# EAGLE schematic v7-flex2811_32x (EAGLE 7.3.0), part 1 of 2

## Sheet 1 of 32
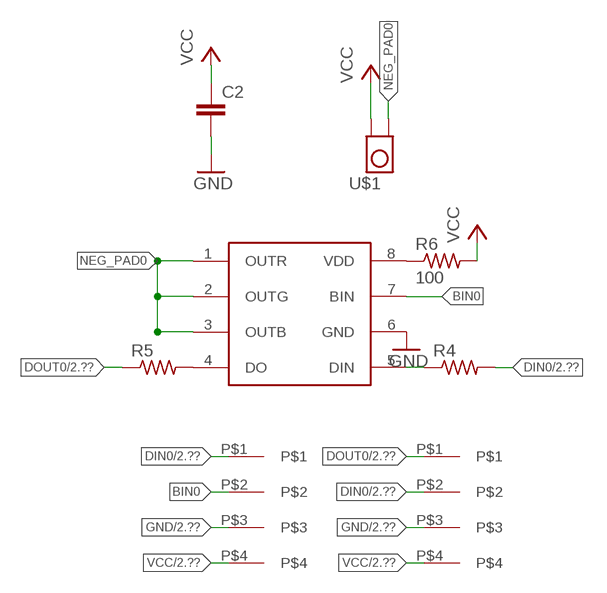
[diagram p0: schematic, sheet 1]

### Parts
C2  C-EUC0201  [C0201]
R4  R-US_R0201  [R0201]
R5  R-US_R0201  [R0201]
R6  100  R-US_R0201  [R0201]
U1  WS2818  [SO08]
U$1  TP_4MM_MED_PAD  [TP_4MM_MED_PAD]
U$3  4PAD  [4PAD]
U$4  4PAD  [4PAD]

### Nets
BIN0: U1.7(BIN) U$3.P$2
DIN0: R4.2 U$3.P$1 U$4.P$2 ; also sheet 2
DOUT0: R5.1 U$4.P$1 ; also sheet 2,3
GND: C2.2 U1.6(GND) U$3.P$3 U$4.P$3 ; also sheet 2,3,4,5,6,7,8,9,10,11,12,13,14,15,16,17,18,19,20,21,22,23,24,25,26,27,28,29,30,31,32
N$4: R4.1 U1.5(DIN)
N$5: R5.2 U1.4(DO)
N$6: R6.1 U1.8(VDD)
NEG_PAD0: U1.1(OUTR) U1.2(OUTG) U1.3(OUTB) U$1.P$1
VCC: C2.1 R6.2 U$1.P$2 U$3.P$4 U$4.P$4 ; also sheet 2,3,4,5,6,7,8,9,10,11,12,13,14,15,16,17,18,19,20,21,22,23,24,25,26,27,28,29,30,31,32

## Sheet 2 of 32
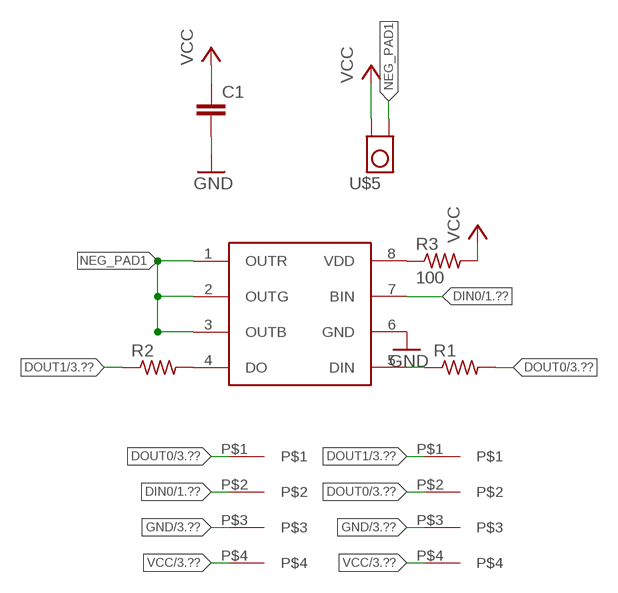
[diagram p1: schematic, sheet 2]

### Parts
C1  C-EUC0201  [C0201]
R1  R-US_R0201  [R0201]
R2  R-US_R0201  [R0201]
R3  100  R-US_R0201  [R0201]
U2  WS2818  [SO08]
U$5  TP_4MM_MED_PAD  [TP_4MM_MED_PAD]
U$7  4PAD  [4PAD]
U$8  4PAD  [4PAD]

### Nets
DIN0: U2.7(BIN) U$7.P$2 ; also sheet 1
DOUT0: R1.2 U$7.P$1 U$8.P$2 ; also sheet 1,3
DOUT1: R2.1 U$8.P$1 ; also sheet 3,4
GND: C1.2 U2.6(GND) U$7.P$3 U$8.P$3 ; also sheet 1,3,4,5,6,7,8,9,10,11,12,13,14,15,16,17,18,19,20,21,22,23,24,25,26,27,28,29,30,31,32
N$1: R1.1 U2.5(DIN)
N$2: R2.2 U2.4(DO)
N$3: R3.1 U2.8(VDD)
NEG_PAD1: U2.1(OUTR) U2.2(OUTG) U2.3(OUTB) U$5.P$1
VCC: C1.1 R3.2 U$5.P$2 U$7.P$4 U$8.P$4 ; also sheet 1,3,4,5,6,7,8,9,10,11,12,13,14,15,16,17,18,19,20,21,22,23,24,25,26,27,28,29,30,31,32

## Sheet 3 of 32
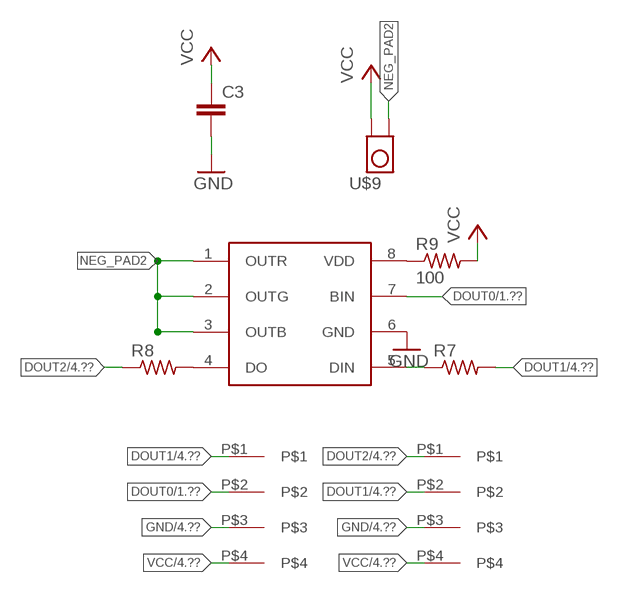
[diagram p2: schematic, sheet 3]

### Parts
C3  C-EUC0201  [C0201]
R7  R-US_R0201  [R0201]
R8  R-US_R0201  [R0201]
R9  100  R-US_R0201  [R0201]
U3  WS2818  [SO08]
U$9  TP_4MM_MED_PAD  [TP_4MM_MED_PAD]
U$11  4PAD  [4PAD]
U$12  4PAD  [4PAD]

### Nets
DOUT0: U3.7(BIN) U$11.P$2 ; also sheet 1,2
DOUT1: R7.2 U$11.P$1 U$12.P$2 ; also sheet 2,4
DOUT2: R8.1 U$12.P$1 ; also sheet 4,5
GND: C3.2 U3.6(GND) U$11.P$3 U$12.P$3 ; also sheet 1,2,4,5,6,7,8,9,10,11,12,13,14,15,16,17,18,19,20,21,22,23,24,25,26,27,28,29,30,31,32
N$7: R7.1 U3.5(DIN)
N$8: R8.2 U3.4(DO)
N$9: R9.1 U3.8(VDD)
NEG_PAD2: U3.1(OUTR) U3.2(OUTG) U3.3(OUTB) U$9.P$1
VCC: C3.1 R9.2 U$9.P$2 U$11.P$4 U$12.P$4 ; also sheet 1,2,4,5,6,7,8,9,10,11,12,13,14,15,16,17,18,19,20,21,22,23,24,25,26,27,28,29,30,31,32

## Sheet 4 of 32
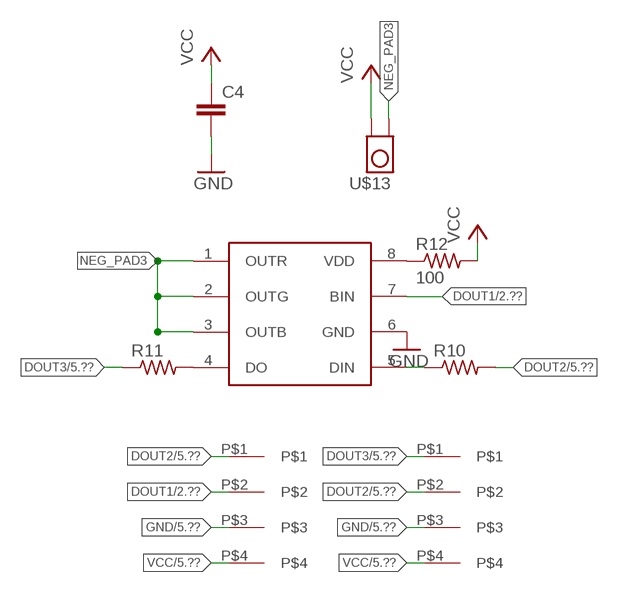
[diagram p3: schematic, sheet 4]

### Parts
C4  C-EUC0201  [C0201]
R10  R-US_R0201  [R0201]
R11  R-US_R0201  [R0201]
R12  100  R-US_R0201  [R0201]
U4  WS2818  [SO08]
U$13  TP_4MM_MED_PAD  [TP_4MM_MED_PAD]
U$15  4PAD  [4PAD]
U$16  4PAD  [4PAD]

### Nets
DOUT1: U4.7(BIN) U$15.P$2 ; also sheet 2,3
DOUT2: R10.2 U$15.P$1 U$16.P$2 ; also sheet 3,5
DOUT3: R11.1 U$16.P$1 ; also sheet 5,6
GND: C4.2 U4.6(GND) U$15.P$3 U$16.P$3 ; also sheet 1,2,3,5,6,7,8,9,10,11,12,13,14,15,16,17,18,19,20,21,22,23,24,25,26,27,28,29,30,31,32
N$10: R10.1 U4.5(DIN)
N$11: R11.2 U4.4(DO)
N$12: R12.1 U4.8(VDD)
NEG_PAD3: U4.1(OUTR) U4.2(OUTG) U4.3(OUTB) U$13.P$1
VCC: C4.1 R12.2 U$13.P$2 U$15.P$4 U$16.P$4 ; also sheet 1,2,3,5,6,7,8,9,10,11,12,13,14,15,16,17,18,19,20,21,22,23,24,25,26,27,28,29,30,31,32

## Sheet 5 of 32
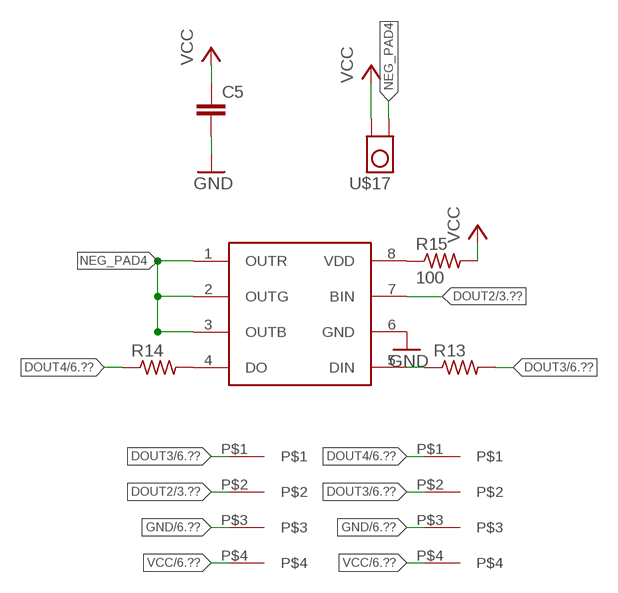
[diagram p4: schematic, sheet 5]

### Parts
C5  C-EUC0201  [C0201]
R13  R-US_R0201  [R0201]
R14  R-US_R0201  [R0201]
R15  100  R-US_R0201  [R0201]
U5  WS2818  [SO08]
U$17  TP_4MM_MED_PAD  [TP_4MM_MED_PAD]
U$19  4PAD  [4PAD]
U$20  4PAD  [4PAD]

### Nets
DOUT2: U5.7(BIN) U$19.P$2 ; also sheet 3,4
DOUT3: R13.2 U$19.P$1 U$20.P$2 ; also sheet 4,6
DOUT4: R14.1 U$20.P$1 ; also sheet 6,7
GND: C5.2 U5.6(GND) U$19.P$3 U$20.P$3 ; also sheet 1,2,3,4,6,7,8,9,10,11,12,13,14,15,16,17,18,19,20,21,22,23,24,25,26,27,28,29,30,31,32
N$13: R13.1 U5.5(DIN)
N$14: R14.2 U5.4(DO)
N$15: R15.1 U5.8(VDD)
NEG_PAD4: U5.1(OUTR) U5.2(OUTG) U5.3(OUTB) U$17.P$1
VCC: C5.1 R15.2 U$17.P$2 U$19.P$4 U$20.P$4 ; also sheet 1,2,3,4,6,7,8,9,10,11,12,13,14,15,16,17,18,19,20,21,22,23,24,25,26,27,28,29,30,31,32

## Sheet 6 of 32
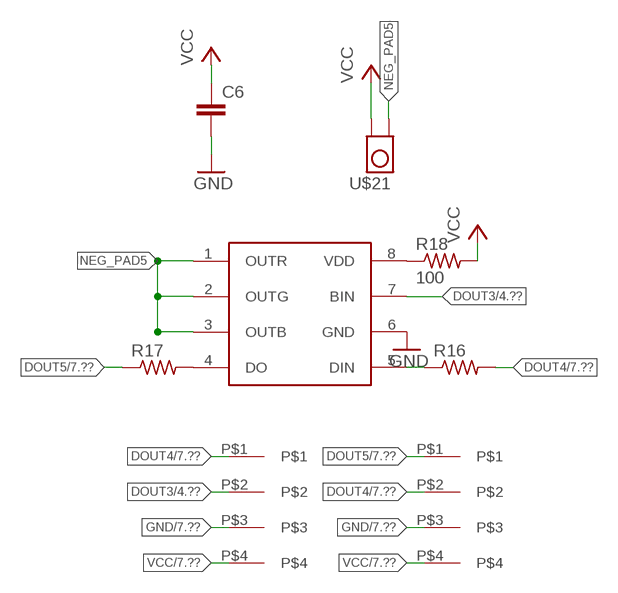
[diagram p5: schematic, sheet 6]

### Parts
C6  C-EUC0201  [C0201]
R16  R-US_R0201  [R0201]
R17  R-US_R0201  [R0201]
R18  100  R-US_R0201  [R0201]
U6  WS2818  [SO08]
U$21  TP_4MM_MED_PAD  [TP_4MM_MED_PAD]
U$23  4PAD  [4PAD]
U$24  4PAD  [4PAD]

### Nets
DOUT3: U6.7(BIN) U$23.P$2 ; also sheet 4,5
DOUT4: R16.2 U$23.P$1 U$24.P$2 ; also sheet 5,7
DOUT5: R17.1 U$24.P$1 ; also sheet 7,8
GND: C6.2 U6.6(GND) U$23.P$3 U$24.P$3 ; also sheet 1,2,3,4,5,7,8,9,10,11,12,13,14,15,16,17,18,19,20,21,22,23,24,25,26,27,28,29,30,31,32
N$16: R16.1 U6.5(DIN)
N$17: R17.2 U6.4(DO)
N$18: R18.1 U6.8(VDD)
NEG_PAD5: U6.1(OUTR) U6.2(OUTG) U6.3(OUTB) U$21.P$1
VCC: C6.1 R18.2 U$21.P$2 U$23.P$4 U$24.P$4 ; also sheet 1,2,3,4,5,7,8,9,10,11,12,13,14,15,16,17,18,19,20,21,22,23,24,25,26,27,28,29,30,31,32

## Sheet 7 of 32
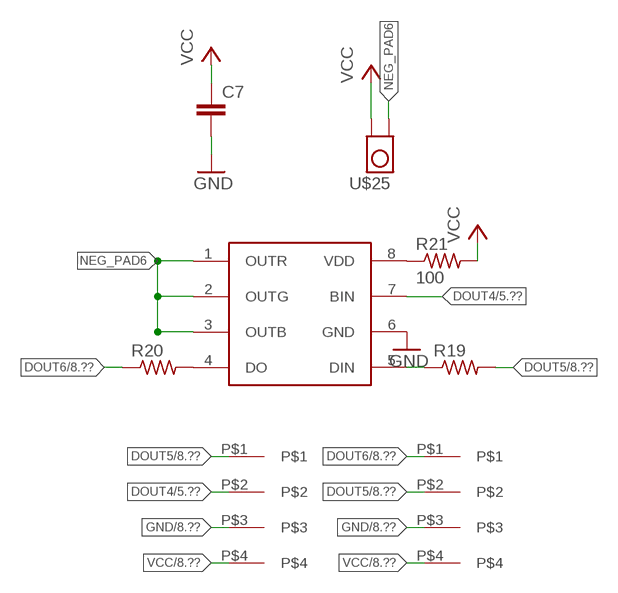
[diagram p6: schematic, sheet 7]

### Parts
C7  C-EUC0201  [C0201]
R19  R-US_R0201  [R0201]
R20  R-US_R0201  [R0201]
R21  100  R-US_R0201  [R0201]
U7  WS2818  [SO08]
U$25  TP_4MM_MED_PAD  [TP_4MM_MED_PAD]
U$27  4PAD  [4PAD]
U$28  4PAD  [4PAD]

### Nets
DOUT4: U7.7(BIN) U$27.P$2 ; also sheet 5,6
DOUT5: R19.2 U$27.P$1 U$28.P$2 ; also sheet 6,8
DOUT6: R20.1 U$28.P$1 ; also sheet 8,9
GND: C7.2 U7.6(GND) U$27.P$3 U$28.P$3 ; also sheet 1,2,3,4,5,6,8,9,10,11,12,13,14,15,16,17,18,19,20,21,22,23,24,25,26,27,28,29,30,31,32
N$19: R19.1 U7.5(DIN)
N$20: R20.2 U7.4(DO)
N$21: R21.1 U7.8(VDD)
NEG_PAD6: U7.1(OUTR) U7.2(OUTG) U7.3(OUTB) U$25.P$1
VCC: C7.1 R21.2 U$25.P$2 U$27.P$4 U$28.P$4 ; also sheet 1,2,3,4,5,6,8,9,10,11,12,13,14,15,16,17,18,19,20,21,22,23,24,25,26,27,28,29,30,31,32

## Sheet 8 of 32
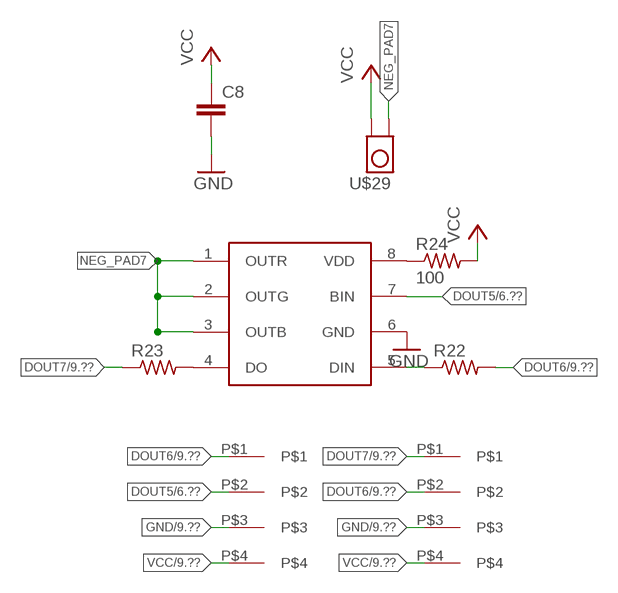
[diagram p7: schematic, sheet 8]

### Parts
C8  C-EUC0201  [C0201]
R22  R-US_R0201  [R0201]
R23  R-US_R0201  [R0201]
R24  100  R-US_R0201  [R0201]
U8  WS2818  [SO08]
U$29  TP_4MM_MED_PAD  [TP_4MM_MED_PAD]
U$31  4PAD  [4PAD]
U$32  4PAD  [4PAD]

### Nets
DOUT5: U8.7(BIN) U$31.P$2 ; also sheet 6,7
DOUT6: R22.2 U$31.P$1 U$32.P$2 ; also sheet 7,9
DOUT7: R23.1 U$32.P$1 ; also sheet 9,10
GND: C8.2 U8.6(GND) U$31.P$3 U$32.P$3 ; also sheet 1,2,3,4,5,6,7,9,10,11,12,13,14,15,16,17,18,19,20,21,22,23,24,25,26,27,28,29,30,31,32
N$22: R22.1 U8.5(DIN)
N$23: R23.2 U8.4(DO)
N$24: R24.1 U8.8(VDD)
NEG_PAD7: U8.1(OUTR) U8.2(OUTG) U8.3(OUTB) U$29.P$1
VCC: C8.1 R24.2 U$29.P$2 U$31.P$4 U$32.P$4 ; also sheet 1,2,3,4,5,6,7,9,10,11,12,13,14,15,16,17,18,19,20,21,22,23,24,25,26,27,28,29,30,31,32

## Sheet 9 of 32
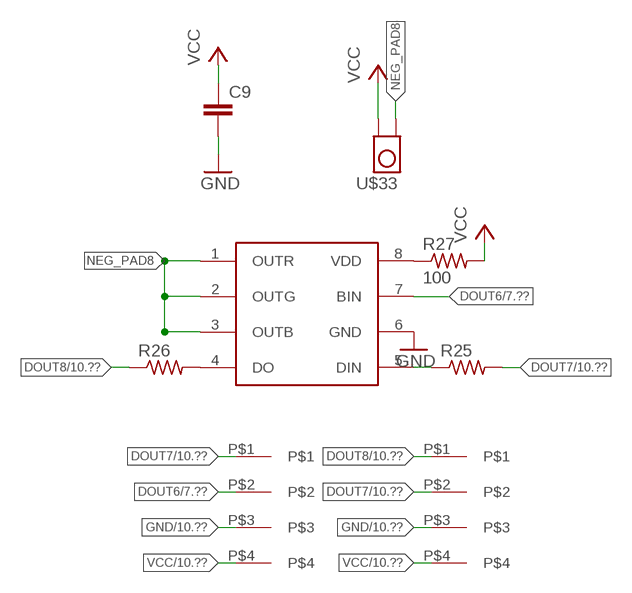
[diagram p8: schematic, sheet 9]

### Parts
C9  C-EUC0201  [C0201]
R25  R-US_R0201  [R0201]
R26  R-US_R0201  [R0201]
R27  100  R-US_R0201  [R0201]
U9  WS2818  [SO08]
U$33  TP_4MM_MED_PAD  [TP_4MM_MED_PAD]
U$35  4PAD  [4PAD]
U$36  4PAD  [4PAD]

### Nets
DOUT6: U9.7(BIN) U$35.P$2 ; also sheet 7,8
DOUT7: R25.2 U$35.P$1 U$36.P$2 ; also sheet 8,10
DOUT8: R26.1 U$36.P$1 ; also sheet 10,11
GND: C9.2 U9.6(GND) U$35.P$3 U$36.P$3 ; also sheet 1,2,3,4,5,6,7,8,10,11,12,13,14,15,16,17,18,19,20,21,22,23,24,25,26,27,28,29,30,31,32
N$25: R25.1 U9.5(DIN)
N$26: R26.2 U9.4(DO)
N$27: R27.1 U9.8(VDD)
NEG_PAD8: U9.1(OUTR) U9.2(OUTG) U9.3(OUTB) U$33.P$1
VCC: C9.1 R27.2 U$33.P$2 U$35.P$4 U$36.P$4 ; also sheet 1,2,3,4,5,6,7,8,10,11,12,13,14,15,16,17,18,19,20,21,22,23,24,25,26,27,28,29,30,31,32

## Sheet 10 of 32
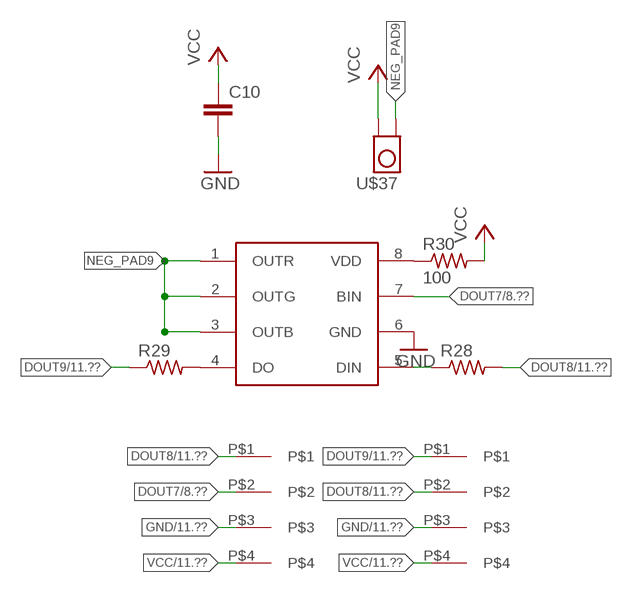
[diagram p9: schematic, sheet 10]

### Parts
C10  C-EUC0201  [C0201]
R28  R-US_R0201  [R0201]
R29  R-US_R0201  [R0201]
R30  100  R-US_R0201  [R0201]
U10  WS2818  [SO08]
U$37  TP_4MM_MED_PAD  [TP_4MM_MED_PAD]
U$39  4PAD  [4PAD]
U$40  4PAD  [4PAD]

### Nets
DOUT7: U10.7(BIN) U$39.P$2 ; also sheet 8,9
DOUT8: R28.2 U$39.P$1 U$40.P$2 ; also sheet 9,11
DOUT9: R29.1 U$40.P$1 ; also sheet 11,12
GND: C10.2 U10.6(GND) U$39.P$3 U$40.P$3 ; also sheet 1,2,3,4,5,6,7,8,9,11,12,13,14,15,16,17,18,19,20,21,22,23,24,25,26,27,28,29,30,31,32
N$28: R28.1 U10.5(DIN)
N$29: R29.2 U10.4(DO)
N$30: R30.1 U10.8(VDD)
NEG_PAD9: U10.1(OUTR) U10.2(OUTG) U10.3(OUTB) U$37.P$1
VCC: C10.1 R30.2 U$37.P$2 U$39.P$4 U$40.P$4 ; also sheet 1,2,3,4,5,6,7,8,9,11,12,13,14,15,16,17,18,19,20,21,22,23,24,25,26,27,28,29,30,31,32

## Sheet 11 of 32
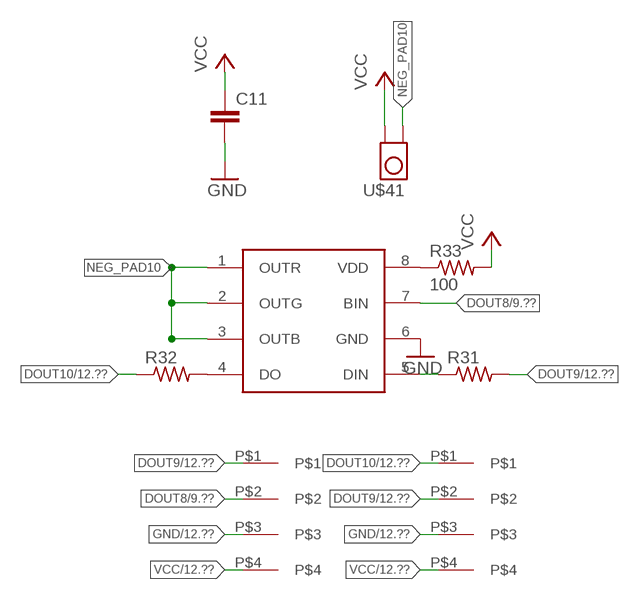
[diagram p10: schematic, sheet 11]

### Parts
C11  C-EUC0201  [C0201]
R31  R-US_R0201  [R0201]
R32  R-US_R0201  [R0201]
R33  100  R-US_R0201  [R0201]
U11  WS2818  [SO08]
U$41  TP_4MM_MED_PAD  [TP_4MM_MED_PAD]
U$43  4PAD  [4PAD]
U$44  4PAD  [4PAD]

### Nets
DOUT8: U11.7(BIN) U$43.P$2 ; also sheet 9,10
DOUT9: R31.2 U$43.P$1 U$44.P$2 ; also sheet 10,12
DOUT10: R32.1 U$44.P$1 ; also sheet 12,13
GND: C11.2 U11.6(GND) U$43.P$3 U$44.P$3 ; also sheet 1,2,3,4,5,6,7,8,9,10,12,13,14,15,16,17,18,19,20,21,22,23,24,25,26,27,28,29,30,31,32
N$31: R31.1 U11.5(DIN)
N$32: R32.2 U11.4(DO)
N$33: R33.1 U11.8(VDD)
NEG_PAD10: U11.1(OUTR) U11.2(OUTG) U11.3(OUTB) U$41.P$1
VCC: C11.1 R33.2 U$41.P$2 U$43.P$4 U$44.P$4 ; also sheet 1,2,3,4,5,6,7,8,9,10,12,13,14,15,16,17,18,19,20,21,22,23,24,25,26,27,28,29,30,31,32

## Sheet 12 of 32
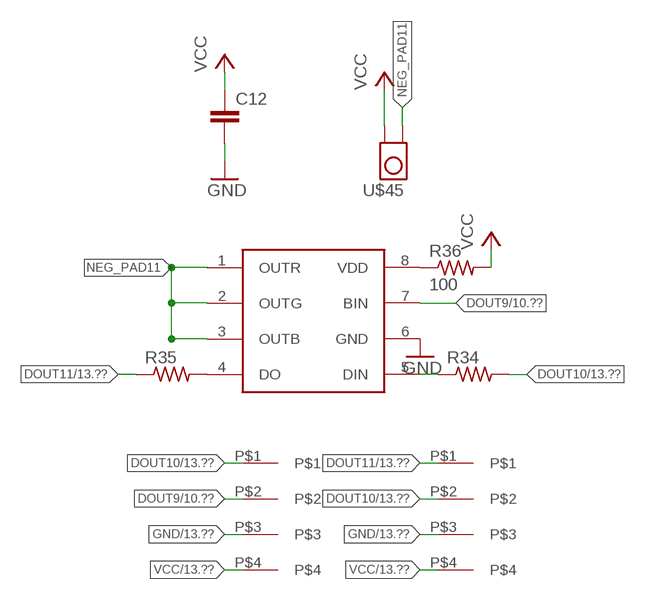
[diagram p11: schematic, sheet 12]

### Parts
C12  C-EUC0201  [C0201]
R34  R-US_R0201  [R0201]
R35  R-US_R0201  [R0201]
R36  100  R-US_R0201  [R0201]
U12  WS2818  [SO08]
U$45  TP_4MM_MED_PAD  [TP_4MM_MED_PAD]
U$47  4PAD  [4PAD]
U$48  4PAD  [4PAD]

### Nets
DOUT9: U12.7(BIN) U$47.P$2 ; also sheet 10,11
DOUT10: R34.2 U$47.P$1 U$48.P$2 ; also sheet 11,13
DOUT11: R35.1 U$48.P$1 ; also sheet 13,14
GND: C12.2 U12.6(GND) U$47.P$3 U$48.P$3 ; also sheet 1,2,3,4,5,6,7,8,9,10,11,13,14,15,16,17,18,19,20,21,22,23,24,25,26,27,28,29,30,31,32
N$34: R34.1 U12.5(DIN)
N$35: R35.2 U12.4(DO)
N$36: R36.1 U12.8(VDD)
NEG_PAD11: U12.1(OUTR) U12.2(OUTG) U12.3(OUTB) U$45.P$1
VCC: C12.1 R36.2 U$45.P$2 U$47.P$4 U$48.P$4 ; also sheet 1,2,3,4,5,6,7,8,9,10,11,13,14,15,16,17,18,19,20,21,22,23,24,25,26,27,28,29,30,31,32

## Sheet 13 of 32
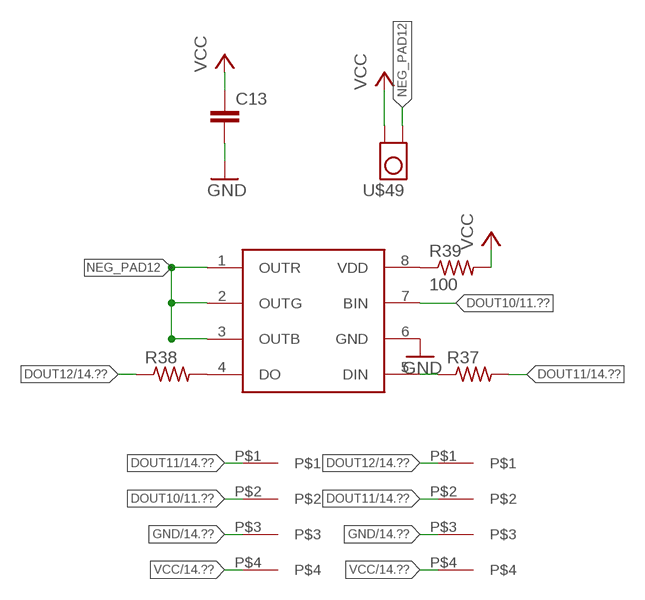
[diagram p12: schematic, sheet 13]

### Parts
C13  C-EUC0201  [C0201]
R37  R-US_R0201  [R0201]
R38  R-US_R0201  [R0201]
R39  100  R-US_R0201  [R0201]
U13  WS2818  [SO08]
U$49  TP_4MM_MED_PAD  [TP_4MM_MED_PAD]
U$51  4PAD  [4PAD]
U$52  4PAD  [4PAD]

### Nets
DOUT10: U13.7(BIN) U$51.P$2 ; also sheet 11,12
DOUT11: R37.2 U$51.P$1 U$52.P$2 ; also sheet 12,14
DOUT12: R38.1 U$52.P$1 ; also sheet 14,15
GND: C13.2 U13.6(GND) U$51.P$3 U$52.P$3 ; also sheet 1,2,3,4,5,6,7,8,9,10,11,12,14,15,16,17,18,19,20,21,22,23,24,25,26,27,28,29,30,31,32
N$37: R37.1 U13.5(DIN)
N$38: R38.2 U13.4(DO)
N$39: R39.1 U13.8(VDD)
NEG_PAD12: U13.1(OUTR) U13.2(OUTG) U13.3(OUTB) U$49.P$1
VCC: C13.1 R39.2 U$49.P$2 U$51.P$4 U$52.P$4 ; also sheet 1,2,3,4,5,6,7,8,9,10,11,12,14,15,16,17,18,19,20,21,22,23,24,25,26,27,28,29,30,31,32

## Sheet 14 of 32
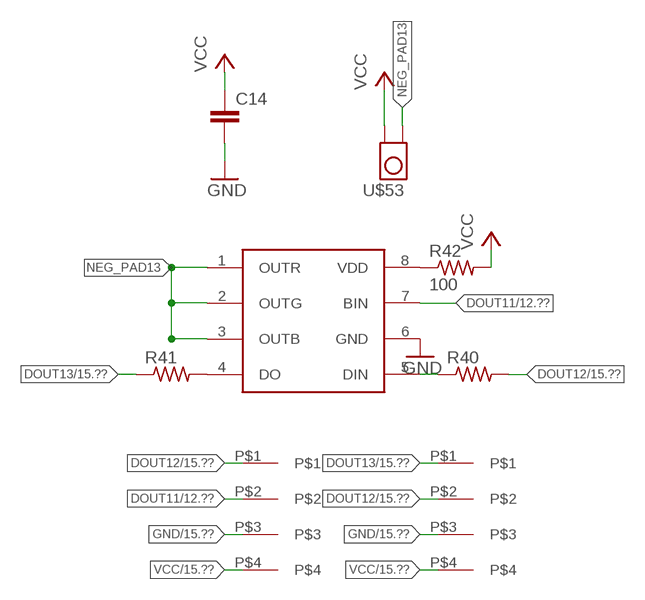
[diagram p13: schematic, sheet 14]

### Parts
C14  C-EUC0201  [C0201]
R40  R-US_R0201  [R0201]
R41  R-US_R0201  [R0201]
R42  100  R-US_R0201  [R0201]
U14  WS2818  [SO08]
U$53  TP_4MM_MED_PAD  [TP_4MM_MED_PAD]
U$55  4PAD  [4PAD]
U$56  4PAD  [4PAD]

### Nets
DOUT11: U14.7(BIN) U$55.P$2 ; also sheet 12,13
DOUT12: R40.2 U$55.P$1 U$56.P$2 ; also sheet 13,15
DOUT13: R41.1 U$56.P$1 ; also sheet 15,16
GND: C14.2 U14.6(GND) U$55.P$3 U$56.P$3 ; also sheet 1,2,3,4,5,6,7,8,9,10,11,12,13,15,16,17,18,19,20,21,22,23,24,25,26,27,28,29,30,31,32
N$40: R40.1 U14.5(DIN)
N$41: R41.2 U14.4(DO)
N$42: R42.1 U14.8(VDD)
NEG_PAD13: U14.1(OUTR) U14.2(OUTG) U14.3(OUTB) U$53.P$1
VCC: C14.1 R42.2 U$53.P$2 U$55.P$4 U$56.P$4 ; also sheet 1,2,3,4,5,6,7,8,9,10,11,12,13,15,16,17,18,19,20,21,22,23,24,25,26,27,28,29,30,31,32

## Sheet 15 of 32
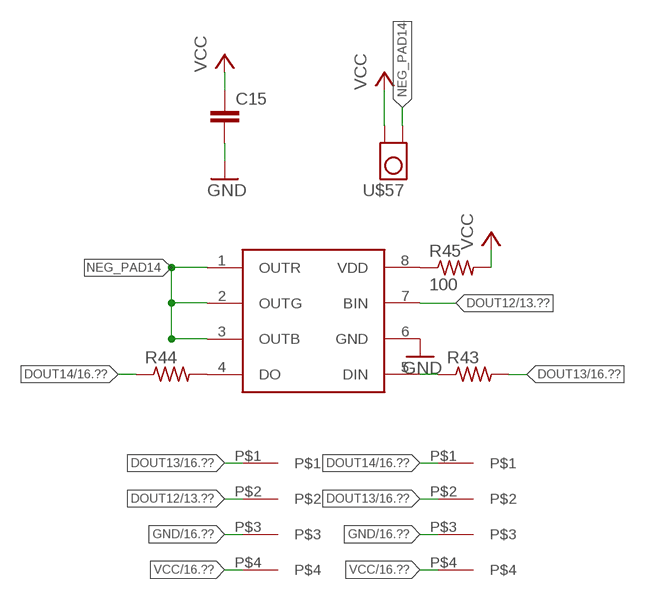
[diagram p14: schematic, sheet 15]

### Parts
C15  C-EUC0201  [C0201]
R43  R-US_R0201  [R0201]
R44  R-US_R0201  [R0201]
R45  100  R-US_R0201  [R0201]
U15  WS2818  [SO08]
U$57  TP_4MM_MED_PAD  [TP_4MM_MED_PAD]
U$59  4PAD  [4PAD]
U$60  4PAD  [4PAD]

### Nets
DOUT12: U15.7(BIN) U$59.P$2 ; also sheet 13,14
DOUT13: R43.2 U$59.P$1 U$60.P$2 ; also sheet 14,16
DOUT14: R44.1 U$60.P$1 ; also sheet 16,17
GND: C15.2 U15.6(GND) U$59.P$3 U$60.P$3 ; also sheet 1,2,3,4,5,6,7,8,9,10,11,12,13,14,16,17,18,19,20,21,22,23,24,25,26,27,28,29,30,31,32
N$43: R43.1 U15.5(DIN)
N$44: R44.2 U15.4(DO)
N$45: R45.1 U15.8(VDD)
NEG_PAD14: U15.1(OUTR) U15.2(OUTG) U15.3(OUTB) U$57.P$1
VCC: C15.1 R45.2 U$57.P$2 U$59.P$4 U$60.P$4 ; also sheet 1,2,3,4,5,6,7,8,9,10,11,12,13,14,16,17,18,19,20,21,22,23,24,25,26,27,28,29,30,31,32

## Sheet 16 of 32
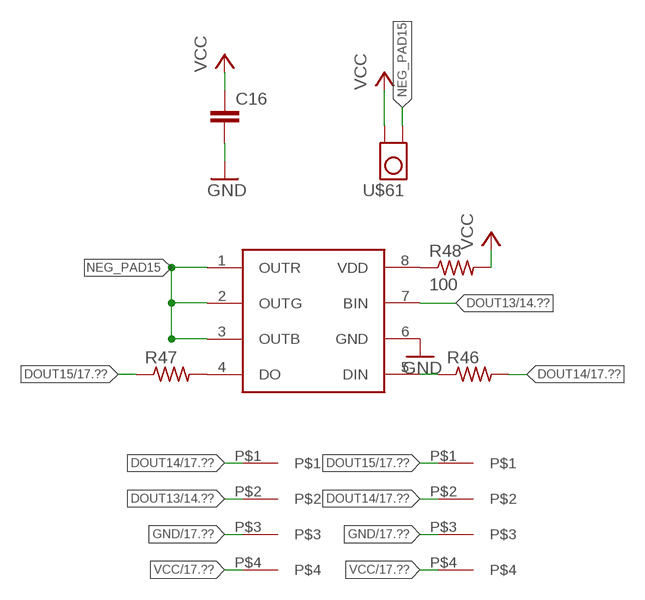
[diagram p15: schematic, sheet 16]

### Parts
C16  C-EUC0201  [C0201]
R46  R-US_R0201  [R0201]
R47  R-US_R0201  [R0201]
R48  100  R-US_R0201  [R0201]
U16  WS2818  [SO08]
U$61  TP_4MM_MED_PAD  [TP_4MM_MED_PAD]
U$63  4PAD  [4PAD]
U$64  4PAD  [4PAD]

### Nets
DOUT13: U16.7(BIN) U$63.P$2 ; also sheet 14,15
DOUT14: R46.2 U$63.P$1 U$64.P$2 ; also sheet 15,17
DOUT15: R47.1 U$64.P$1 ; also sheet 17,18
GND: C16.2 U16.6(GND) U$63.P$3 U$64.P$3 ; also sheet 1,2,3,4,5,6,7,8,9,10,11,12,13,14,15,17,18,19,20,21,22,23,24,25,26,27,28,29,30,31,32
N$46: R46.1 U16.5(DIN)
N$47: R47.2 U16.4(DO)
N$48: R48.1 U16.8(VDD)
NEG_PAD15: U16.1(OUTR) U16.2(OUTG) U16.3(OUTB) U$61.P$1
VCC: C16.1 R48.2 U$61.P$2 U$63.P$4 U$64.P$4 ; also sheet 1,2,3,4,5,6,7,8,9,10,11,12,13,14,15,17,18,19,20,21,22,23,24,25,26,27,28,29,30,31,32

## Sheet 17 of 32
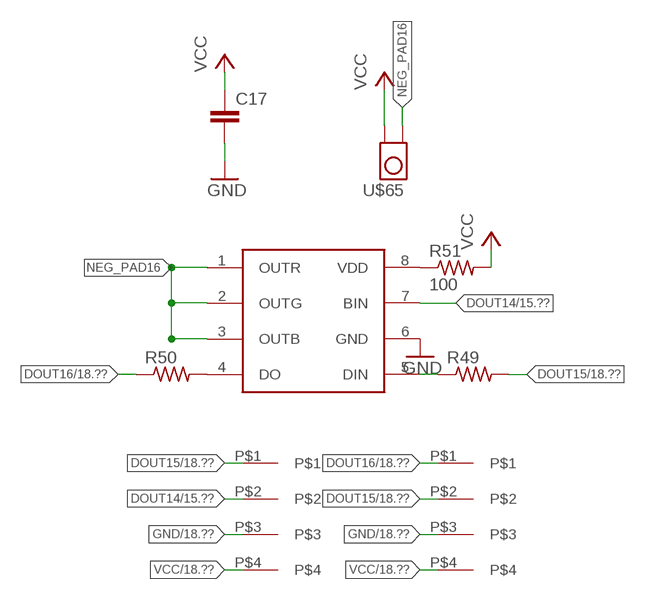
[diagram p16: schematic, sheet 17]

### Parts
C17  C-EUC0201  [C0201]
R49  R-US_R0201  [R0201]
R50  R-US_R0201  [R0201]
R51  100  R-US_R0201  [R0201]
U17  WS2818  [SO08]
U$65  TP_4MM_MED_PAD  [TP_4MM_MED_PAD]
U$67  4PAD  [4PAD]
U$68  4PAD  [4PAD]

### Nets
DOUT14: U17.7(BIN) U$67.P$2 ; also sheet 15,16
DOUT15: R49.2 U$67.P$1 U$68.P$2 ; also sheet 16,18
DOUT16: R50.1 U$68.P$1 ; also sheet 18,19
GND: C17.2 U17.6(GND) U$67.P$3 U$68.P$3 ; also sheet 1,2,3,4,5,6,7,8,9,10,11,12,13,14,15,16,18,19,20,21,22,23,24,25,26,27,28,29,30,31,32
N$49: R49.1 U17.5(DIN)
N$50: R50.2 U17.4(DO)
N$51: R51.1 U17.8(VDD)
NEG_PAD16: U17.1(OUTR) U17.2(OUTG) U17.3(OUTB) U$65.P$1
VCC: C17.1 R51.2 U$65.P$2 U$67.P$4 U$68.P$4 ; also sheet 1,2,3,4,5,6,7,8,9,10,11,12,13,14,15,16,18,19,20,21,22,23,24,25,26,27,28,29,30,31,32

## Sheet 18 of 32
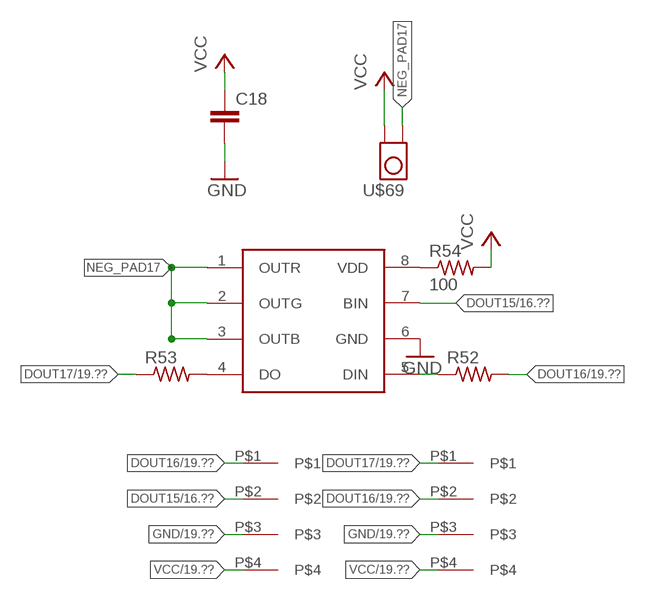
[diagram p17: schematic, sheet 18]

### Parts
C18  C-EUC0201  [C0201]
R52  R-US_R0201  [R0201]
R53  R-US_R0201  [R0201]
R54  100  R-US_R0201  [R0201]
U18  WS2818  [SO08]
U$69  TP_4MM_MED_PAD  [TP_4MM_MED_PAD]
U$71  4PAD  [4PAD]
U$72  4PAD  [4PAD]

### Nets
DOUT15: U18.7(BIN) U$71.P$2 ; also sheet 16,17
DOUT16: R52.2 U$71.P$1 U$72.P$2 ; also sheet 17,19
DOUT17: R53.1 U$72.P$1 ; also sheet 19,20
GND: C18.2 U18.6(GND) U$71.P$3 U$72.P$3 ; also sheet 1,2,3,4,5,6,7,8,9,10,11,12,13,14,15,16,17,19,20,21,22,23,24,25,26,27,28,29,30,31,32
N$52: R52.1 U18.5(DIN)
N$53: R53.2 U18.4(DO)
N$54: R54.1 U18.8(VDD)
NEG_PAD17: U18.1(OUTR) U18.2(OUTG) U18.3(OUTB) U$69.P$1
VCC: C18.1 R54.2 U$69.P$2 U$71.P$4 U$72.P$4 ; also sheet 1,2,3,4,5,6,7,8,9,10,11,12,13,14,15,16,17,19,20,21,22,23,24,25,26,27,28,29,30,31,32

## Sheet 19 of 32
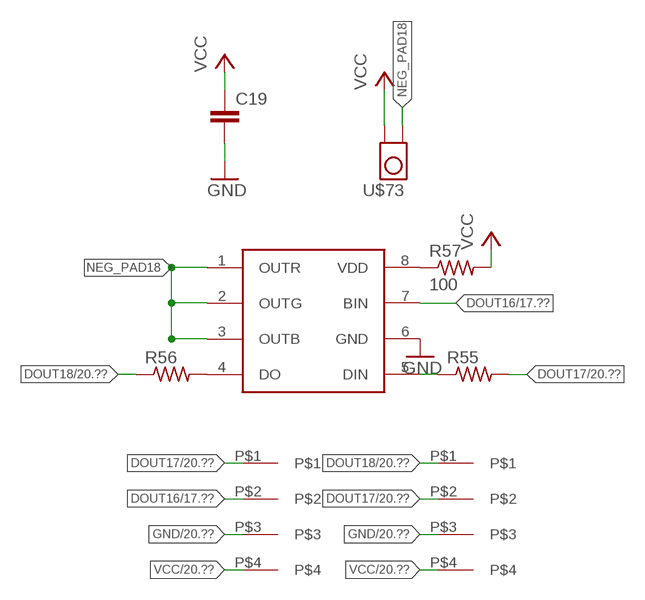
[diagram p18: schematic, sheet 19]

### Parts
C19  C-EUC0201  [C0201]
R55  R-US_R0201  [R0201]
R56  R-US_R0201  [R0201]
R57  100  R-US_R0201  [R0201]
U19  WS2818  [SO08]
U$73  TP_4MM_MED_PAD  [TP_4MM_MED_PAD]
U$75  4PAD  [4PAD]
U$76  4PAD  [4PAD]

### Nets
DOUT16: U19.7(BIN) U$75.P$2 ; also sheet 17,18
DOUT17: R55.2 U$75.P$1 U$76.P$2 ; also sheet 18,20
DOUT18: R56.1 U$76.P$1 ; also sheet 20,21
GND: C19.2 U19.6(GND) U$75.P$3 U$76.P$3 ; also sheet 1,2,3,4,5,6,7,8,9,10,11,12,13,14,15,16,17,18,20,21,22,23,24,25,26,27,28,29,30,31,32
N$55: R55.1 U19.5(DIN)
N$56: R56.2 U19.4(DO)
N$57: R57.1 U19.8(VDD)
NEG_PAD18: U19.1(OUTR) U19.2(OUTG) U19.3(OUTB) U$73.P$1
VCC: C19.1 R57.2 U$73.P$2 U$75.P$4 U$76.P$4 ; also sheet 1,2,3,4,5,6,7,8,9,10,11,12,13,14,15,16,17,18,20,21,22,23,24,25,26,27,28,29,30,31,32

## Sheet 20 of 32
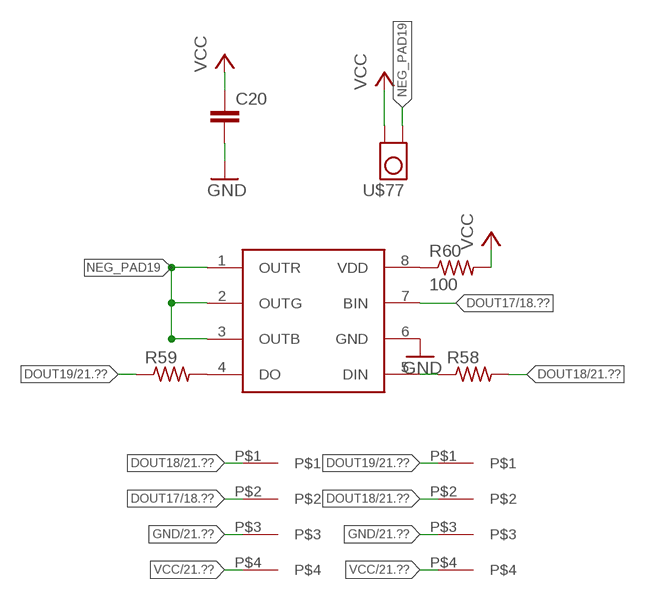
[diagram p19: schematic, sheet 20]

### Parts
C20  C-EUC0201  [C0201]
R58  R-US_R0201  [R0201]
R59  R-US_R0201  [R0201]
R60  100  R-US_R0201  [R0201]
U20  WS2818  [SO08]
U$77  TP_4MM_MED_PAD  [TP_4MM_MED_PAD]
U$79  4PAD  [4PAD]
U$80  4PAD  [4PAD]

### Nets
DOUT17: U20.7(BIN) U$79.P$2 ; also sheet 18,19
DOUT18: R58.2 U$79.P$1 U$80.P$2 ; also sheet 19,21
DOUT19: R59.1 U$80.P$1 ; also sheet 21,22
GND: C20.2 U20.6(GND) U$79.P$3 U$80.P$3 ; also sheet 1,2,3,4,5,6,7,8,9,10,11,12,13,14,15,16,17,18,19,21,22,23,24,25,26,27,28,29,30,31,32
N$58: R58.1 U20.5(DIN)
N$59: R59.2 U20.4(DO)
N$60: R60.1 U20.8(VDD)
NEG_PAD19: U20.1(OUTR) U20.2(OUTG) U20.3(OUTB) U$77.P$1
VCC: C20.1 R60.2 U$77.P$2 U$79.P$4 U$80.P$4 ; also sheet 1,2,3,4,5,6,7,8,9,10,11,12,13,14,15,16,17,18,19,21,22,23,24,25,26,27,28,29,30,31,32

## Sheet 21 of 32
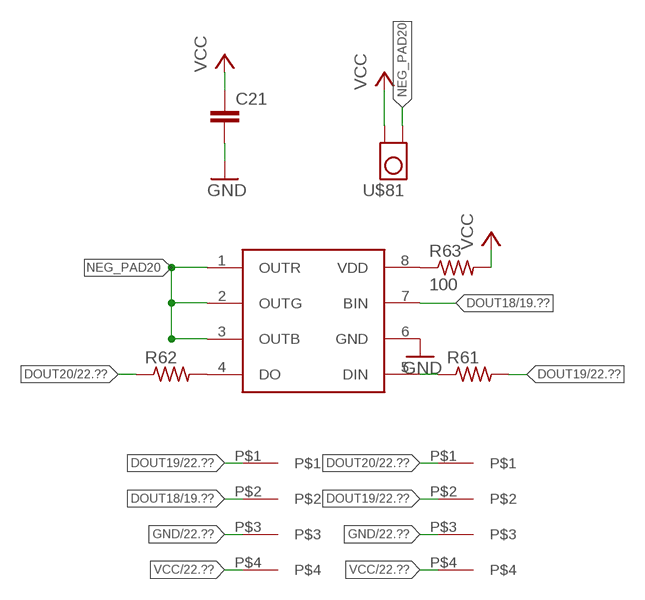
[diagram p20: schematic, sheet 21]

### Parts
C21  C-EUC0201  [C0201]
R61  R-US_R0201  [R0201]
R62  R-US_R0201  [R0201]
R63  100  R-US_R0201  [R0201]
U21  WS2818  [SO08]
U$81  TP_4MM_MED_PAD  [TP_4MM_MED_PAD]
U$83  4PAD  [4PAD]
U$84  4PAD  [4PAD]

### Nets
DOUT18: U21.7(BIN) U$83.P$2 ; also sheet 19,20
DOUT19: R61.2 U$83.P$1 U$84.P$2 ; also sheet 20,22
DOUT20: R62.1 U$84.P$1 ; also sheet 22,23
GND: C21.2 U21.6(GND) U$83.P$3 U$84.P$3 ; also sheet 1,2,3,4,5,6,7,8,9,10,11,12,13,14,15,16,17,18,19,20,22,23,24,25,26,27,28,29,30,31,32
N$61: R61.1 U21.5(DIN)
N$62: R62.2 U21.4(DO)
N$63: R63.1 U21.8(VDD)
NEG_PAD20: U21.1(OUTR) U21.2(OUTG) U21.3(OUTB) U$81.P$1
VCC: C21.1 R63.2 U$81.P$2 U$83.P$4 U$84.P$4 ; also sheet 1,2,3,4,5,6,7,8,9,10,11,12,13,14,15,16,17,18,19,20,22,23,24,25,26,27,28,29,30,31,32

## Sheet 22 of 32
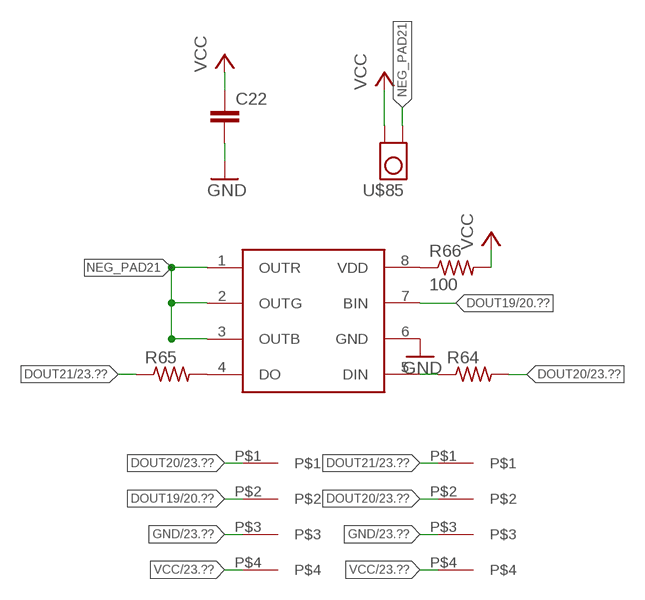
[diagram p21: schematic, sheet 22]

### Parts
C22  C-EUC0201  [C0201]
R64  R-US_R0201  [R0201]
R65  R-US_R0201  [R0201]
R66  100  R-US_R0201  [R0201]
U22  WS2818  [SO08]
U$85  TP_4MM_MED_PAD  [TP_4MM_MED_PAD]
U$87  4PAD  [4PAD]
U$88  4PAD  [4PAD]

### Nets
DOUT19: U22.7(BIN) U$87.P$2 ; also sheet 20,21
DOUT20: R64.2 U$87.P$1 U$88.P$2 ; also sheet 21,23
DOUT21: R65.1 U$88.P$1 ; also sheet 23,24
GND: C22.2 U22.6(GND) U$87.P$3 U$88.P$3 ; also sheet 1,2,3,4,5,6,7,8,9,10,11,12,13,14,15,16,17,18,19,20,21,23,24,25,26,27,28,29,30,31,32
N$64: R64.1 U22.5(DIN)
N$65: R65.2 U22.4(DO)
N$66: R66.1 U22.8(VDD)
NEG_PAD21: U22.1(OUTR) U22.2(OUTG) U22.3(OUTB) U$85.P$1
VCC: C22.1 R66.2 U$85.P$2 U$87.P$4 U$88.P$4 ; also sheet 1,2,3,4,5,6,7,8,9,10,11,12,13,14,15,16,17,18,19,20,21,23,24,25,26,27,28,29,30,31,32

## Sheet 23 of 32
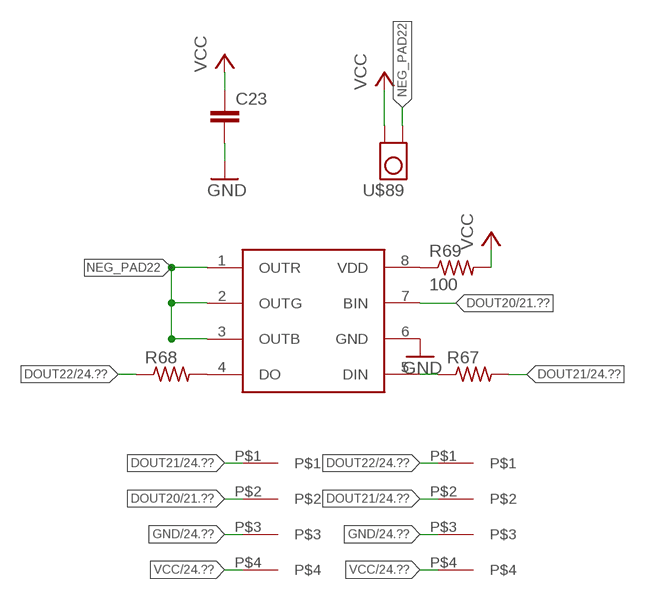
[diagram p22: schematic, sheet 23]

### Parts
C23  C-EUC0201  [C0201]
R67  R-US_R0201  [R0201]
R68  R-US_R0201  [R0201]
R69  100  R-US_R0201  [R0201]
U23  WS2818  [SO08]
U$89  TP_4MM_MED_PAD  [TP_4MM_MED_PAD]
U$91  4PAD  [4PAD]
U$92  4PAD  [4PAD]

### Nets
DOUT20: U23.7(BIN) U$91.P$2 ; also sheet 21,22
DOUT21: R67.2 U$91.P$1 U$92.P$2 ; also sheet 22,24
DOUT22: R68.1 U$92.P$1 ; also sheet 24,25
GND: C23.2 U23.6(GND) U$91.P$3 U$92.P$3 ; also sheet 1,2,3,4,5,6,7,8,9,10,11,12,13,14,15,16,17,18,19,20,21,22,24,25,26,27,28,29,30,31,32
N$67: R67.1 U23.5(DIN)
N$68: R68.2 U23.4(DO)
N$69: R69.1 U23.8(VDD)
NEG_PAD22: U23.1(OUTR) U23.2(OUTG) U23.3(OUTB) U$89.P$1
VCC: C23.1 R69.2 U$89.P$2 U$91.P$4 U$92.P$4 ; also sheet 1,2,3,4,5,6,7,8,9,10,11,12,13,14,15,16,17,18,19,20,21,22,24,25,26,27,28,29,30,31,32

## Sheet 24 of 32
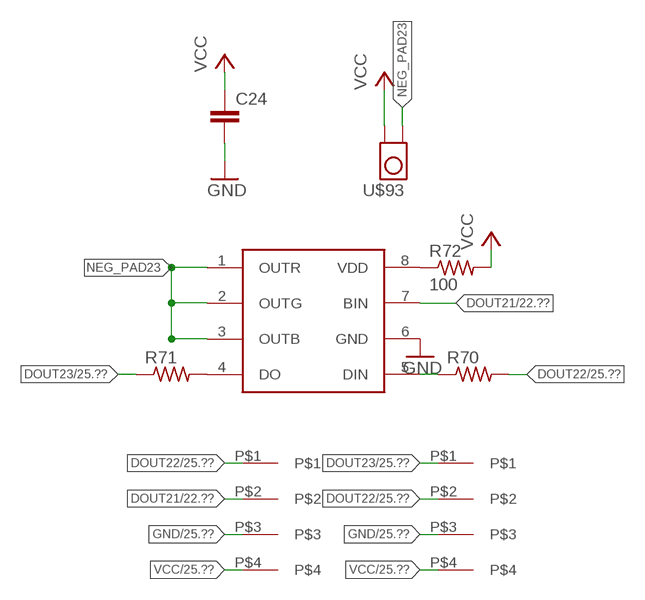
[diagram p23: schematic, sheet 24]

### Parts
C24  C-EUC0201  [C0201]
R70  R-US_R0201  [R0201]
R71  R-US_R0201  [R0201]
R72  100  R-US_R0201  [R0201]
U24  WS2818  [SO08]
U$93  TP_4MM_MED_PAD  [TP_4MM_MED_PAD]
U$95  4PAD  [4PAD]
U$96  4PAD  [4PAD]

### Nets
DOUT21: U24.7(BIN) U$95.P$2 ; also sheet 22,23
DOUT22: R70.2 U$95.P$1 U$96.P$2 ; also sheet 23,25
DOUT23: R71.1 U$96.P$1 ; also sheet 25,26
GND: C24.2 U24.6(GND) U$95.P$3 U$96.P$3 ; also sheet 1,2,3,4,5,6,7,8,9,10,11,12,13,14,15,16,17,18,19,20,21,22,23,25,26,27,28,29,30,31,32
N$70: R70.1 U24.5(DIN)
N$71: R71.2 U24.4(DO)
N$72: R72.1 U24.8(VDD)
NEG_PAD23: U24.1(OUTR) U24.2(OUTG) U24.3(OUTB) U$93.P$1
VCC: C24.1 R72.2 U$93.P$2 U$95.P$4 U$96.P$4 ; also sheet 1,2,3,4,5,6,7,8,9,10,11,12,13,14,15,16,17,18,19,20,21,22,23,25,26,27,28,29,30,31,32